# EAGLE design ktrainer (EAGLE 8.3.1)
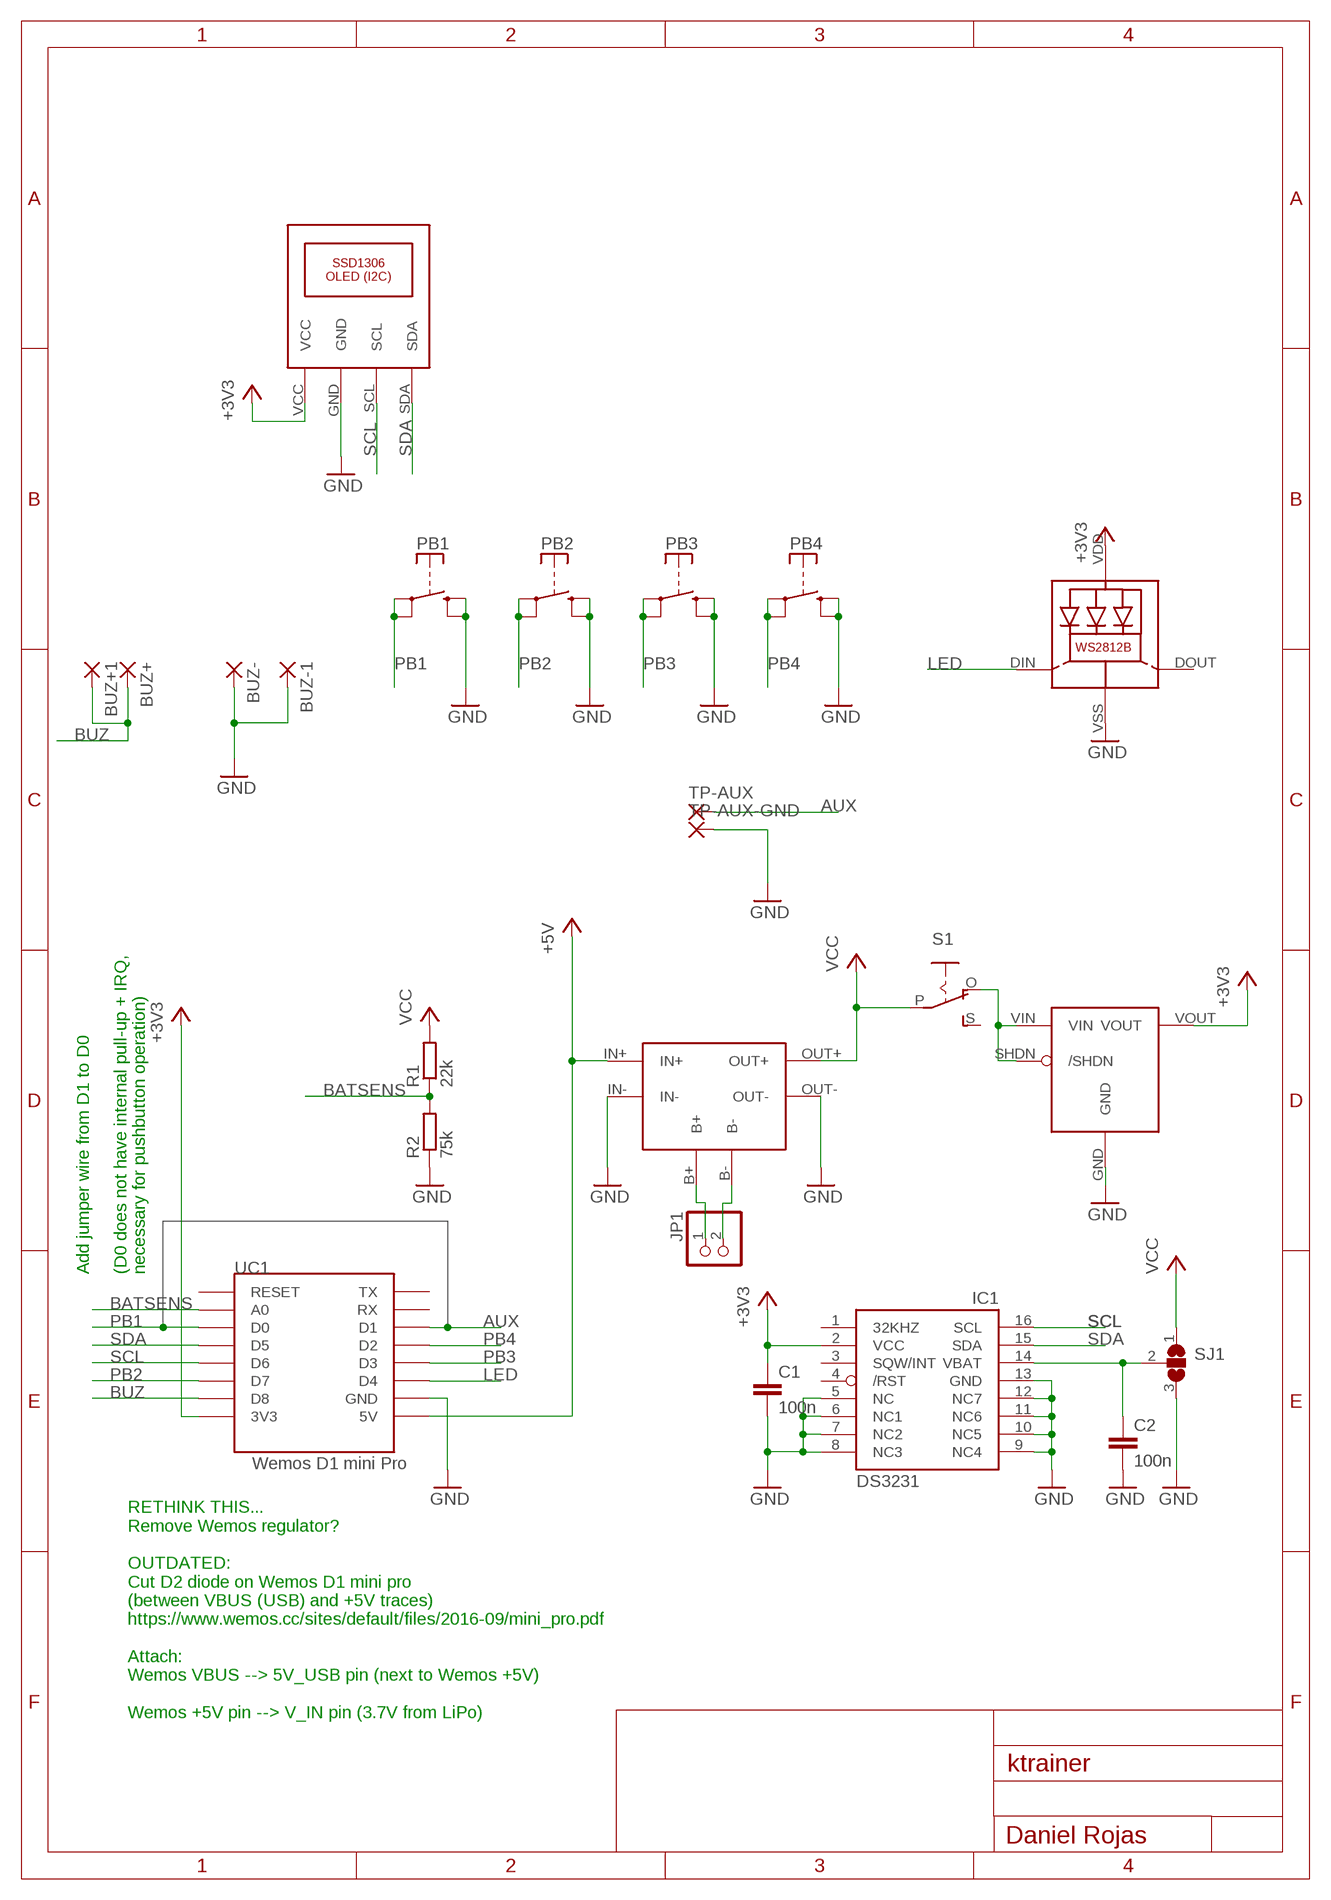
[diagram p0: schematic, sheet 1]

## Parts
BUZ+  SMD2  [SMD1,27-2,54]
BUZ+1  SMD2  [SMD1,27-2,54]
BUZ-  SMD2  [SMD1,27-2,54]
BUZ-1  SMD2  [SMD1,27-2,54]
C1  100n  C-EUC0805  [C0805]
C2  100n  C-EUC0805  [C0805]
IC1  DS3231/SO  [SO16W]
JP1  PINHD-1X2  [1X02]
LED1  WS2812B  [WS2812B]
PB1  SWITCH-SKRA  [SWITCH-SKRA-PKG]
PB2  SWITCH-SKRA  [SWITCH-SKRA-PKG]
PB3  SWITCH-SKRA  [SWITCH-SKRA-PKG]
PB4  SWITCH-SKRA  [SWITCH-SKRA-PKG]
R1  22k  R-EU_R0805  [R0805]
R2  75k  R-EU_R0805  [R0805]
S1  SWITCH-MSK12D04-SLIDER-SMD  [SWITCH-MSK12D04-SLIDER-SMD-PKG]
SJ1  SJ2W  [SJ_2]
TP-AUX  SMD2  [SMD1,27-2,54]
TP-AUX-GND  SMD2  [SMD1,27-2,54]
U$1  TP4056-LIPO-CHG-PCBTP4056-PCB-SMD  [TP4056-PCB-SMD]
U$2  SSD1306-OLED-128X64-I2CSSD1306-OLED-128X64-SMD  [SSD1306-OLED-128X64-SMD]
U$3  POLOLU-S7V8F3-3V3-STEP-UP-DOWNPOLOLU-S7V8F3-PAD  [POLOLU-S7V8F3-SMD]
UC1  Wemos D1 mini Pro  WEMOS-D1-MINIWEMOS-D1-MINI-SMD  [WEMOS-D1-MINI-SMD]

## Nets
+3V3: C1.1 IC1.2(VCC) LED1.VDD U$2.VCC U$3.VOUT UC1.3V3
+5V: U$1.IN+ UC1.5V
AUX: TP-AUX.1(P) UC1.D1
B-: JP1.2 U$1.B-
BATSENS: R1.1 R2.2 UC1.A0
BUZ: BUZ+1.1(P) BUZ+.1(P) UC1.D8
GND: BUZ-1.1(P) BUZ-.1(P) C1.2 C2.2 IC1.5(NC) IC1.6(NC1) IC1.7(NC2) IC1.8(NC3) IC1.9(NC4) IC1.10(NC5) IC1.11(NC6) IC1.12(NC7) IC1.13(GND) LED1.VSS(GND) PB1.P$1(P) PB1.P$2(P) PB2.P$1(P) PB2.P$2(P) PB3.P$1(P) PB3.P$2(P) PB4.P$1(P) PB4.P$2(P) R2.1 SJ1.3 TP-AUX-GND.1(P) U$1.IN- U$1.OUT- U$2.GND U$3.GND UC1.GND
LED: LED1.DIN(DI) UC1.D4
N$8: S1.O U$3.SHDN(/SHDN) U$3.VIN
PB1: PB1.P$3(S) PB1.P$4(S) UC1.D0
PB2: PB2.P$3(S) PB2.P$4(S) UC1.D7
PB3: PB3.P$3(S) PB3.P$4(S) UC1.D3
PB4: PB4.P$3(S) PB4.P$4(S) UC1.D2
SCL: IC1.16(SCL) U$2.SCL UC1.D6
SDA: IC1.15(SDA) U$2.SDA UC1.D5
VBAT: C2.1 IC1.14(VBAT) SJ1.2
VCC: JP1.1 R1.2 S1.P SJ1.1 U$1.B+ U$1.OUT+
Unconnected: IC1.1(32KHZ) IC1.3(SQW/INT) IC1.4(/RST) LED1.DOUT(DO) S1.S UC1.RESET UC1.RX UC1.TX

## Notes on the sheet
- Add jumper wire from D1 to D0
  
  (D0 does not have internal pull-up + IRQ,
  necessary for pushbutton operation)
- RETHINK THIS...
  Remove Wemos regulator?
  
  OUTDATED:
  Cut D2 diode on Wemos D1 mini pro
  (between VBUS (USB) and +5V traces)
  https://www.wemos.cc/sites/default/files/2016-09/mini_pro.pdf
  
  Attach:
  Wemos VBUS --> 5V_USB pin (next to Wemos +5V)
  
  Wemos +5V pin --> V_IN pin (3.7V from LiPo)

## Library data of the parts
BUZ+ BUZ+1 BUZ- BUZ-1 TP-AUX TP-AUX-GND = wirepad:SMD2: SMD PAD
C1 C2 = rcl:C-EU: CAPACITOR, European symbol
IC1 = adafruit:DS3231
JP1 = pinhead:PINHD-1X2: PIN HEADER
LED1 = WS2812B:WS2812B: Features and Benefits  * Intelligent reverse connect protection, the power supply reverse connection does not damage the IC. * The control circuit and the LED share the only power source. Control circuit and RGB chip are integrated in a package of 5050 components, form a complete control of pixel point.  * Built-in signal reshaping circuit, after wave reshaping to the next driver, ensure wave-form distortion not accumulate.  * Built-in electric reset circuit and power lost reset circuit.  * Each pixel of the three primary color can achieve 256 brightness display, completed 16777216 color full color display, and scan frequency not less than 400Hz/s.  * Cascading port transmission signal by single line.  * Any two point the distance more than 5m transmission signal without any increase circuit.  * When the refresh rate is 30fps, cascade number are not less than1024 points.  * Send data at speeds of 800Kbps.  *The color of the light were highly consistent, cost-effective. Applications  Full-color module, Full color soft lights a lamp strip. LED decorative lighting, Indoor/outdoor LED video irregular screen. General description WS2812B is a intelligent control LED light source that the control circuit and RGB chip are integrated in a package of 5050 components. It internal include intelligent digital port data latch and signal reshaping amplification drive circuit. Also include a precision internal oscillator and a 12V voltage programmable constant curre-nt control part, effectively ensuring the pixel point light color height consistent. The data transfer protocol use single NZR communication mode. After the pixel power-on reset, the DIN port receive data from controller, the first pixel collect initial 24bit data then sent to the internal data latch, the other data which reshaping by the internal signal reshaping amplification circuit sent to the next cascade pixel through the DO port. After transmission for each pixel,the signal to reduce 24bit. pixel adopt auto reshaping transmit technology, making the pixel cascade number is not limited the signal transmission, only depend on the speed of signal transmission. LED with low driving voltage, environmental protection and energy saving, high brightness, scattering angle is large, good consistency, low power, long life and other advantages. The control chip integrated in LED above becoming more simple circuit, small volume, convenient installation. Absolute Maximum Ratings Power supply voltage: VDD +3.5V..+5.3V Input voltage: VI -0.5V..VDD+0.5V based on WS2812 from https://github.com/adafruit/Adafruit-Eagle-Library
PB1-PB4 = formatc1702-switches:SWITCH-SKRA
R1 R2 = rcl:R-EU_: RESISTOR, European symbol
S1 = formatc1702-switches:SWITCH-MSK12D04-SLIDER-SMD
SJ1 = jumper:SJ2W: SMD solder JUMPER
U$1 = formatc1702-pcbs:TP4056-LIPO-CHG-PCB: TP4056-based LiPo charger module
U$2 = formatc1702-pcbs:SSD1306-OLED-128X64-I2C
U$3 = formatc1702-pcbs:POLOLU-S7V8F3-3V3-STEP-UP-DOWN
UC1 = formatc1702-pcbs:WEMOS-D1-MINI: WeMos.cc D1 mini ESP8266 module

## Board
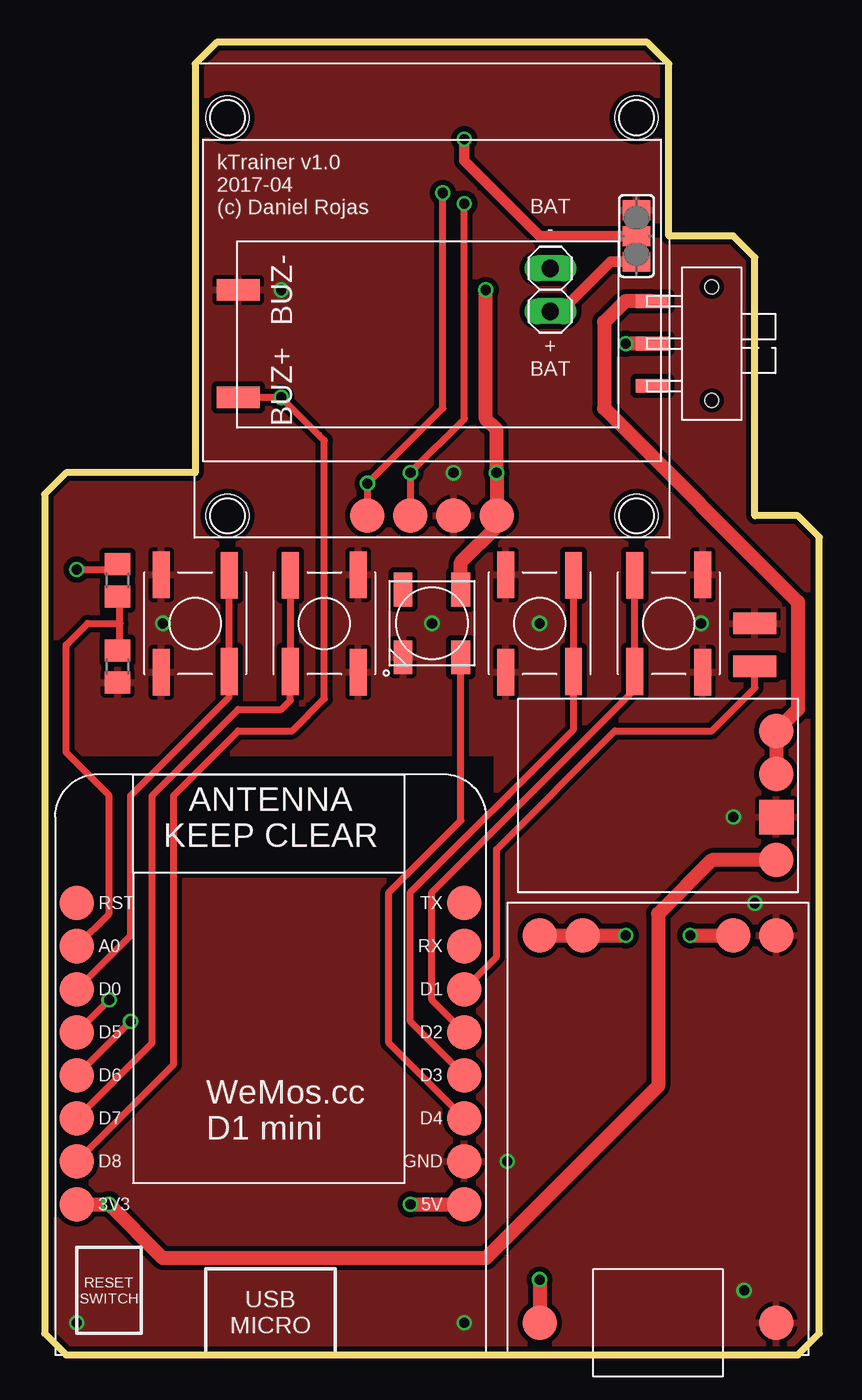
[diagram p1: board, top side]
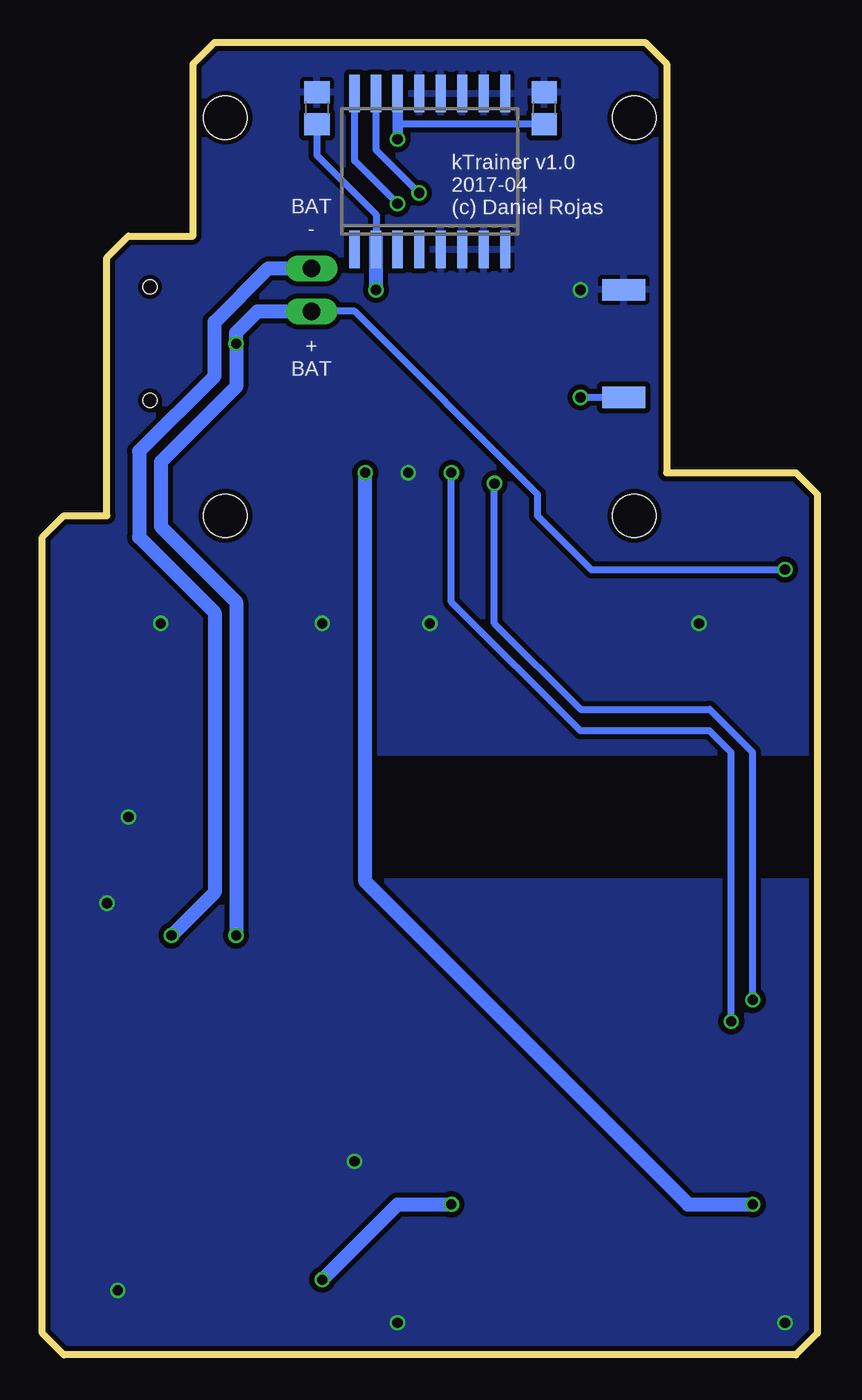
[diagram p2: board, bottom side, seen from below]

Size 45.72 x 77.47 mm. Coordinates in mm from the lower left corner, seen from the top.
Outline: 0,1.27 1.27,0 44.45,0 45.72,1.27 45.72,48.26 44.45,49.53 41.91,49.53 41.91,64.77 40.64,66.04 36.83,66.04 36.83,76.2 35.56,77.47 10.16,77.47 8.89,76.2 8.89,52.07 1.27,52.07 0,50.8 0,1.27
Copper layers (1*16): Top 0.035mm / dielectric 1.5mm / Bottom 0.035mm
Design rules "ITEADstudio_DRC *": minimum track width 6mil, minimum drill 12mil, track to track 6mil, track to pad 6mil, pad to pad 6mil, via to via 6mil, smd to smd 0mil, copper to edge 10mil, drill to drill 10mil, minimum pad ring 10mil, minimum via ring 6mil, stop-mask expansion 2mil, vias tented up to drill 100mil, thermal gap 10mil
Holes 2.54 mm at 10.8,73.03 34.93,73.03 34.93,49.53 10.8,49.53

### Footprints (pad centres in the part's own frame; a part is rotated, then mirrored left to right if it is on the bottom)
SMD1,27-2,54 = smd 1.27 x 2.54: 1 0,0
C0805 = smd 1.3 x 1.5: 1 -0.95,0; 2 0.95,0
SO16W = smd 0.6 x 2.2: 1 -4.445,-4.6; 2 -3.175,-4.6; 3 -1.905,-4.6; 4 -0.635,-4.6; 5 0.635,-4.6; 6 1.905,-4.6; 7 3.175,-4.6; 8 4.445,-4.6; 9 4.445,4.6; 10 3.175,4.6; 11 1.905,4.6; 12 0.635,4.6; 13 -0.635,4.6; 14 -1.905,4.6; 15 -3.175,4.6; 16 -4.445,4.6
1X02 = drill 1.016 long: 1 -1.27,0; 2 1.27,0
WS2812B = smd 2 x 1.1: DIN 2,1.7; DOUT -2,-1.7; VDD -2,1.7; VSS 2,-1.7
SWITCH-SKRA-PKG = smd 2.75 x 1: P$1 -2.875,2; P$2 2.875,2; P$3 -2.84,-2; P$4 2.84,-2
R0805 = smd 1.3 x 1.5: 1 -0.95,0; 2 0.95,0
SWITCH-MSK12D04-SLIDER-SMD-PKG = smd 0.8 x 2: O -2.5,-3.5; P 0,-3.5; S 2.5,-3.5 | hole 0.8: -3.35,0; 3.35,0
SJ_2 = smd 1.168 x 1.6: 1 -1.524,0; 2 0,0; 3 1.524,0
TP4056-PCB-SMD = smd 2.032 x 2.032: B+ -4.445,12.065; B- 4.445,12.065; IN+ -6.985,-10.795; IN- 6.985,-10.795; OUT+ -6.985,12.065; OUT- 6.985,12.065
SSD1306-OLED-128X64-SMD = smd 2.032 x 2.032: GND -1.27,12.7; SCL 1.27,12.7; SDA 3.81,12.7; VCC -3.81,12.7
POLOLU-S7V8F3-SMD = smd 2.032 x 2.032: GND -1.27,0; SHDN 3.81,0; VIN 1.27,0; VOUT -3.81,0
WEMOS-D1-MINI-SMD = smd 2.032 x 2.032: 3V3 -11.43,-7.62; 5V 11.43,-7.62; A0 -11.43,7.62; D0 -11.43,5.08; D1 11.43,5.08; D2 11.43,2.54; D3 11.43,0; D4 11.43,-2.54; D5 -11.43,2.54; D6 -11.43,0; D7 -11.43,-2.54; D8 -11.43,-5.08; GND 11.43,-5.08; RESET -11.43,10.16; RX 11.43,7.62; TX 11.43,10.16

### Placement (x,y rotation side)
BUZ+  11.43,56.52 90 top
BUZ+1  11.43,56.52 270 bottom
BUZ-  11.43,62.87 270 top
BUZ-1  11.43,62.87 90 bottom
C1  29.52,73.58 90 bottom
C2  16.11,73.58 90 bottom
IC1  22.86,69.85 0 bottom
JP1  29.84,62.87 90 top
LED1  22.86,43.18 270 top
PB1  8.89,43.18 90 top
PB2  16.51,43.18 270 top
PB3  29.21,43.18 90 top
PB4  36.83,43.18 270 top
R1  4.32,45.72 90 top
R2  4.32,40.64 90 top
S1  39.37,59.69 270 top
SJ1  34.93,66.04 90 top
TP-AUX  41.91,40.64 90 top
TP-AUX-GND  41.91,43.18 90 top
U$1  36.2,12.7 0 top
U$2  22.86,62.23 180 top
U$3  43.18,33.02 90 top
UC1  13.34,16.51 0 top

### Tracks (layer width: path | path; a pad name or v marks a point on that pad's centre or on a via)
+3V3  (via drill 0.6)
  Top 0.813: U$3.VOUT 39.37,29.21 36.2,26.04 36.2,15.88 26.04,5.71 6.99,5.71 v3.81,8.89 UC1.3V3 | 24.56,44.88 LED1.VDD 24.56,46.78 26.67,48.9 U$2.VCC v26.67,52.07 26.67,54.61 26.04,55.24 v26.04,62.87
  Bottom 0.406: C1.1 29.52,70.8 26.04,67.31 26.04,66.04 IC1.2 26.04,64.77
  Bottom 0.813: v3.81,8.89 7.62,8.89 26.67,27.94 v26.67,52.07 | v26.04,62.87 26.04,66.04
+5V  (via drill 0.6)
  Top 0.813: v21.59,8.89 UC1.5V | v29.21,4.45 U$1.IN+
  Bottom 0.813: v29.21,4.45 UC1.5V v21.59,8.89
AUX
  Top 0.406: UC1.D1 26.67,23.5 26.67,29.84 33.66,36.83 39.37,36.83 41.91,39.37 TP-AUX.1
B-  (via drill 0.6)
  Top 0.813: v38.1,24.77 U$1.B-
  Bottom 0.813: v38.1,24.77 35.56,27.3 35.56,43.81 40.01,48.26 40.01,53.34 35.56,57.78 35.56,60.96 32.38,64.14 JP1.2
BATSENS
  Top 0.406: UC1.A0 3.81,26.04 3.81,33.02 1.27,35.56 1.27,41.91 2.54,43.18 4.45,43.18 | 4.28,41.51 R2.2 4.45,41.72 4.45,43.18 | 4.45,43.18 4.45,44.64 R1.1
BUZ  (via drill 0.6)
  Top 0.406: UC1.D8 7.62,17.14 7.62,33.02 11.43,36.83 14.61,36.83 16.51,38.73 16.51,53.98 16.19,54.29 v13.97,56.52 BUZ+1.1
  Bottom 0.406: BUZ+1.1 v13.97,56.52
GND  (via drill 0.6)
  other vias: 29.21,43.18 6.99,43.18 38.73,43.18 24.77,1.91 1.91,1.91 22.86,43.18 41.91,26.67 40.64,31.75 41.27,3.81 27.3,11.43 24.13,52.07 13.97,62.87
  pour Top (isolate 0.305): 0,35.56 26.67,35.56 26.67,27.94 0,27.94 0,0 45.72,0 45.72,78.74 0,78.74
  pour Bottom (isolate 0.305): 0,78.74 0,35.56 26.67,35.56 26.67,27.94 0,27.94 0,0 45.72,0 45.72,78.74
LED
  Top 0.406: UC1.D4 20.32,18.41 20.32,27.3 24.56,31.55 LED1.DIN
N$8
  Top 0.813: U$3.VIN U$3.SHDN 44.45,38.1 44.45,44.45 33.02,55.88 33.02,60.96 34.25,62.19 S1.O
PB1
  Top 0.406: PB1.P$4 PB1.P$3 10.89,38.83 5.08,33.02 5.08,24.77 UC1.D0
PB2
  Top 0.406: PB2.P$3 PB2.P$4 14.51,38.64 13.97,38.1 11.43,38.1 6.35,33.02 6.35,18.41 UC1.D7
PB3
  Top 0.406: UC1.D3 21.59,19.68 21.59,27.3 31.21,36.92 PB3.P$3 PB3.P$4
PB4
  Top 0.406: UC1.D2 22.86,20.95 22.86,27.3 34.83,39.27 PB4.P$4 | 34.83,40.29 PB4.P$4 | PB4.P$4 PB4.P$3
SCL  (via drill 0.6)
  Top 0.406: UC1.D6 v5.08,19.68 | U$2.SCL v21.59,52.07 24.77,55.24 v24.77,67.94
  Bottom 0.406: v5.08,19.68 5.08,35.56 6.35,36.83 13.97,36.83 21.59,44.45 v21.59,52.07 | v24.77,67.94 27.3,70.48 IC1.16
SDA  (via drill 0.6)
  Top 0.406: UC1.D5 v3.81,20.95 | U$2.SDA v19.05,51.44 23.5,55.88 v23.5,68.58
  Bottom 0.406: v3.81,20.95 3.81,35.56 6.35,38.1 13.97,38.1 19.05,43.18 v19.05,51.44 | v23.5,68.58 26.04,71.12 IC1.15
VBAT  (via drill 0.6)
  Top 0.61: v24.77,71.75 24.77,70.48 29.21,66.04 SJ1.2
  Bottom 0.406: C2.1 24.53,72.63 arc-90 24.77,72.39
  Bottom 0.61: v24.77,71.75 24.77,72.39 IC1.14
VCC  (via drill 0.6)
  Top 0.406: v1.91,46.35 4.04,46.35 R1.2
  Top 0.61: SJ1.1 33.4,64.52 30.48,61.59 JP1.1
  Top 0.813: S1.P v34.29,59.69 | U$1.OUT+ U$1.B+ v34.29,24.77
  Bottom 0.406: v1.91,46.35 13.34,46.35 16.51,49.53 16.51,50.8 27.3,61.59 30.48,61.59 | JP1.1 29.77,61.52
  Bottom 0.813: v34.29,24.77 34.29,44.45 38.73,48.9 38.73,52.7 34.29,57.15 v34.29,59.69 34.29,60.33 33.02,61.59 30.48,61.59 JP1.1

### Text on the board
tNames: kTrainer v1.0 / 2017-04 / (c) Daniel Rojas | BAT / - | + / BAT
bNames: kTrainer v1.0 / 2017-04 / (c) Daniel Rojas | BAT / - | + / BAT